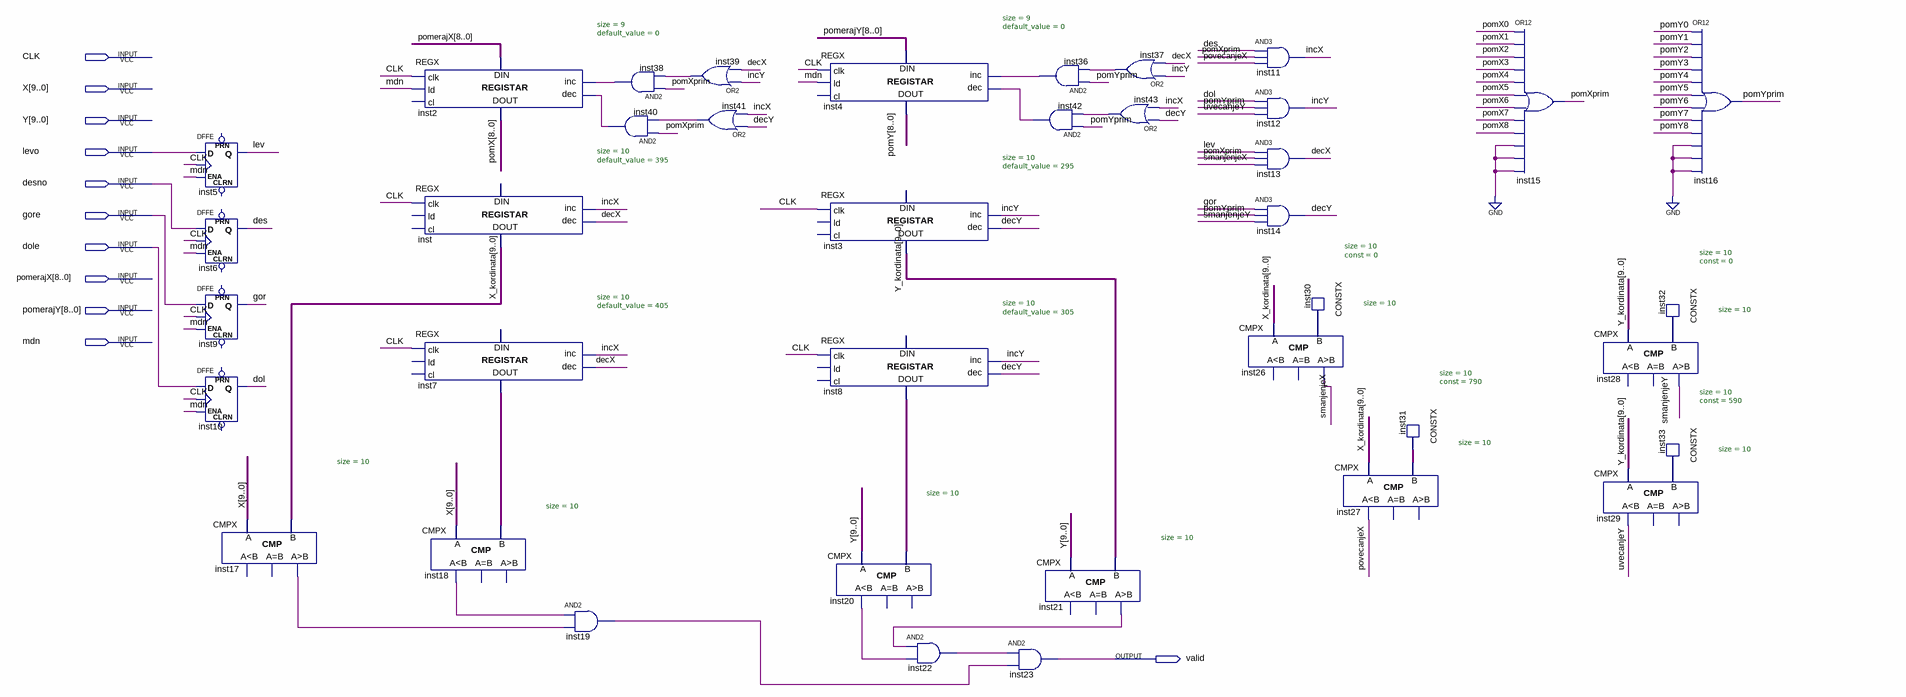
[diagram p0: schematic sheet]
// Quartus schematic Strelica.bdf as structural Verilog: 39 symbols, 11 pins
module Strelica (
  input  CLK,
  input  [9:0] X,
  input  [9:0] Y,
  input  levo,
  input  desno,
  input  gore,
  input  dole,
  input  [8:0] pomerajX,
  input  [8:0] pomerajY,
  input  mdn,
  output valid
);

  wire decX, decY, des, dol, gor, incX, incY, inst17_gr, inst18_ls, inst19_out, inst20_ls, inst21_gr,
       inst22_out, inst36_out, inst37_out, inst38_out, inst39_out, inst40_out, inst41_out, inst42_out,
       inst43_out, lev, pomXprim, pomYprim, povecanjeX, smanjenjeX, smanjenjeY, uvecanjeY;
  wire [8:0] pomX, pomY;
  wire [9:0] inst7_data_out, inst8_data_out, inst30_data, inst31_data, inst32_data, inst33_data, X_kordinata,
       Y_kordinata;

  DFFE inst5 (.D(levo), .CLK(CLK), .ENA(mdn), .Q(lev));  // open: PRN, CLRN
  DFFE inst6 (.D(desno), .CLK(CLK), .ENA(mdn), .Q(des));  // open: PRN, CLRN
  DFFE inst9 (.D(gore), .CLK(CLK), .ENA(mdn), .Q(gor));  // open: PRN, CLRN
  DFFE inst10 (.D(dole), .CLK(CLK), .ENA(mdn), .Q(dol));  // open: PRN, CLRN
  CMPX #(.size(10)) inst17 (.A(X), .B(X_kordinata), .gr(inst17_gr));  // open: ls, eq
  REGX #(.size(9), .default_value(0)) inst2 (
    .clk(CLK), .ld(mdn), .inc(inst38_out), .dec(inst40_out), .data_in(pomerajX), .data_out(pomX));  // open: cl
  REGX #(.size(10), .default_value(395)) inst (
    .clk(CLK), .inc(incX), .dec(decX), .data_out(X_kordinata));  // open: ld, cl, data_in
  REGX #(.size(10), .default_value(405)) inst7 (
    .clk(CLK), .inc(incX), .dec(decX), .data_out(inst7_data_out));  // open: ld, cl, data_in
  CMPX #(.size(10)) inst18 (.A(X), .B(inst7_data_out), .ls(inst18_ls));  // open: eq, gr
  and inst19 (inst19_out, inst18_ls, inst17_gr);
  and inst38 (inst38_out, pomXprim, inst39_out);
  and inst40 (inst40_out, pomXprim, inst41_out);
  or inst39 (inst39_out, incY, decX);
  or inst41 (inst41_out, decY, incX);
  REGX #(.size(9), .default_value(0)) inst4 (
    .clk(CLK), .ld(mdn), .inc(inst36_out), .dec(inst42_out), .data_in(pomerajY), .data_out(pomY));  // open: cl
  REGX #(.size(10), .default_value(295)) inst3 (
    .clk(CLK), .inc(incY), .dec(decY), .data_out(Y_kordinata));  // open: ld, cl, data_in
  REGX #(.size(10), .default_value(305)) inst8 (
    .clk(CLK), .inc(incY), .dec(decY), .data_out(inst8_data_out));  // open: ld, cl, data_in
  CMPX #(.size(10)) inst20 (.A(Y), .B(inst8_data_out), .ls(inst20_ls));  // open: eq, gr
  and inst22 (inst22_out, inst21_gr, inst20_ls);
  and inst23 (valid, inst22_out, inst19_out);
  and inst36 (inst36_out, pomYprim, inst37_out);
  and inst42 (inst42_out, pomYprim, inst43_out);
  CMPX #(.size(10)) inst21 (.A(Y), .B(Y_kordinata), .gr(inst21_gr));  // open: ls, eq
  or inst43 (inst43_out, decY, incX);
  or inst37 (inst37_out, incY, decX);
  and inst11 (incX, des, pomXprim, povecanjeX);
  and inst12 (incY, dol, pomYprim, uvecanjeY);
  and inst13 (decX, lev, pomXprim, smanjenjeX);
  and inst14 (decY, gor, pomYprim, smanjenjeY);
  CMPX #(.size(10)) inst26 (.A(X_kordinata), .B(inst30_data), .gr(smanjenjeX));  // open: ls, eq
  CONSTX #(.size(10), .\const (0)) inst30 (.data(inst30_data));
  CMPX #(.size(10)) inst27 (.A(X_kordinata), .B(inst31_data), .ls(povecanjeX));  // open: eq, gr
  CONSTX #(.size(10), .\const (790)) inst31 (.data(inst31_data));
  or inst15 (pomXprim, pomX[0], pomX[1], pomX[2], pomX[3], pomX[4], pomX[5], pomX[6], pomX[7], pomX[8], 1'b0, 1'b0, 1'b0);
  CMPX #(.size(10)) inst28 (.A(Y_kordinata), .B(inst32_data), .gr(smanjenjeY));  // open: ls, eq
  CMPX #(.size(10)) inst29 (.A(Y_kordinata), .B(inst33_data), .ls(uvecanjeY));  // open: eq, gr
  CONSTX #(.size(10), .\const (0)) inst32 (.data(inst32_data));
  CONSTX #(.size(10), .\const (590)) inst33 (.data(inst33_data));
  or inst16 (pomYprim, pomY[0], pomY[1], pomY[2], pomY[3], pomY[4], pomY[5], pomY[6], pomY[7], pomY[8], 1'b0, 1'b0, 1'b0);
endmodule
